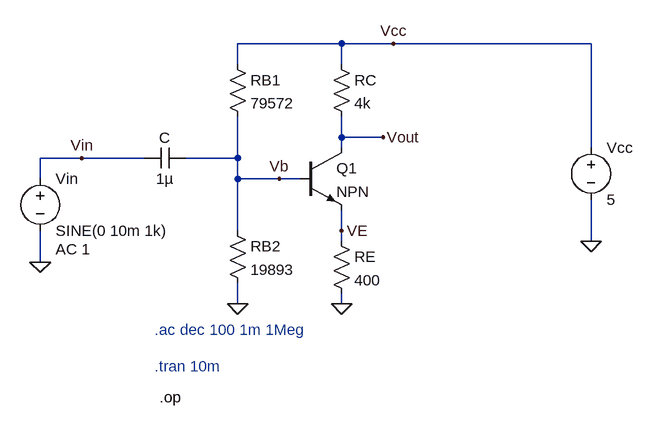
[diagram p0: schematic common_emitter.asc]
common_emitter.asc, the LTspice schematic file:
Version 4
SHEET 1 880 680
WIRE 320 -48 160 -48
WIRE 400 -48 320 -48
WIRE 704 -48 400 -48
WIRE 160 -16 160 -48
WIRE 320 -16 320 -48
WIRE 320 96 320 64
WIRE 384 96 320 96
WIRE 320 112 320 96
WIRE 704 112 704 -48
WIRE -80 128 -144 128
WIRE 16 128 -80 128
WIRE 160 128 160 64
WIRE 160 128 80 128
WIRE -144 160 -144 128
WIRE 160 160 160 128
WIRE 224 160 160 160
WIRE 256 160 224 160
WIRE 160 240 160 160
WIRE 320 240 320 208
WIRE 320 256 320 240
WIRE 704 256 704 192
WIRE -144 288 -144 240
WIRE 160 352 160 320
WIRE 320 352 320 336
FLAG -144 288 0
FLAG 320 352 0
FLAG 704 256 0
FLAG 384 96 Vout
FLAG 160 352 0
FLAG -80 128 Vin
FLAG 224 160 Vb
FLAG 320 240 VE
FLAG 400 -48 Vcc
SYMBOL res 304 240 R0
SYMATTR InstName RE
SYMATTR Value 400
SYMBOL voltage 704 96 R0
WINDOW 123 0 0 Left 0
WINDOW 39 0 0 Left 0
SYMATTR InstName Vcc
SYMATTR Value 5
SYMBOL npn 256 112 R0
SYMATTR InstName Q1
SYMBOL voltage -144 144 R0
WINDOW 123 24 124 Left 2
WINDOW 39 24 124 Left 2
SYMATTR Value2 AC 1
SYMATTR InstName Vin
SYMATTR Value SINE(0 10m 1k)
SYMBOL res 304 -32 R0
SYMATTR InstName RC
SYMATTR Value 4k
SYMBOL res 144 -32 R0
SYMATTR InstName RB1
SYMATTR Value 79572
SYMBOL res 144 224 R0
SYMATTR InstName RB2
SYMATTR Value 19893
SYMBOL cap 80 112 R90
WINDOW 0 0 32 VBottom 2
WINDOW 3 32 32 VTop 2
SYMATTR InstName C
SYMATTR Value 1µ
TEXT 32 392 Left 2 ;.ac dec 100 1m 1Meg
TEXT 32 448 Left 2 ;.tran 10m
TEXT 40 496 Left 2 !.op

The netlist it stands for:
* common_emitter.asc
RE VE 0 400
Vcc Vcc 0 5
Q1 Vout Vb VE 0 NPN
Vin Vin 0 SINE(0 10m 1k) AC 1
RC Vcc Vout 4k
RB1 Vcc Vb 79572
RB2 Vb 0 19893
C Vb Vin 1µ
.model NPN NPN
.model PNP PNP
.lib standard.bjt
* .ac dec 100 1m 1Meg
* .tran 10m
.op
.backanno
.end